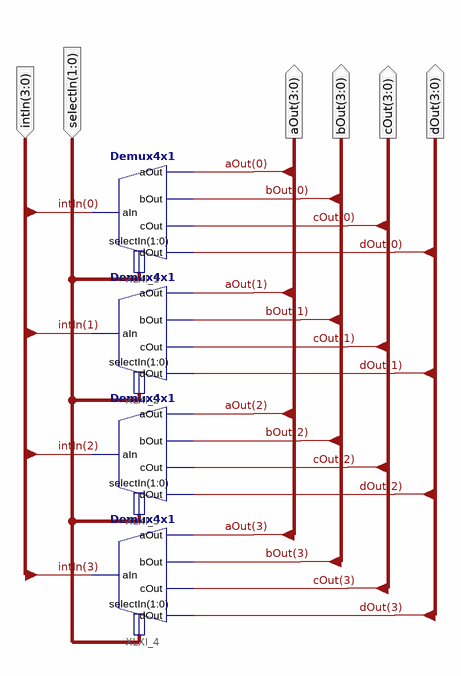
[diagram p0: schematic sheet 1]
// Xilinx ISE schematic Demux4x4b.sch (spartan3e) as structural Verilog: 4 symbols, 6 ports
module Demux4x4b (
  input  [3:0] intIn,
  input  [1:0] selectIn,
  output [3:0] aOut,
  output [3:0] bOut,
  output [3:0] cOut,
  output [3:0] dOut
);

  Demux4x1 XLXI_4 (.selectIn(selectIn), .aIn(intIn[3]), .aOut(aOut[3]), .bOut(bOut[3]), .cOut(cOut[3]), .dOut(dOut[3]));
  Demux4x1 XLXI_3 (.selectIn(selectIn), .aIn(intIn[2]), .aOut(aOut[2]), .bOut(bOut[2]), .cOut(cOut[2]), .dOut(dOut[2]));
  Demux4x1 XLXI_2 (.selectIn(selectIn), .aIn(intIn[1]), .aOut(aOut[1]), .bOut(bOut[1]), .cOut(cOut[1]), .dOut(dOut[1]));
  Demux4x1 XLXI_1 (.selectIn(selectIn), .aIn(intIn[0]), .aOut(aOut[0]), .bOut(bOut[0]), .cOut(cOut[0]), .dOut(dOut[0]));
endmodule
